# EAGLE design BIM Backplane (EAGLE 5.12)
FUNCTION: BIM 3; PARTNO: 67996-114HLF
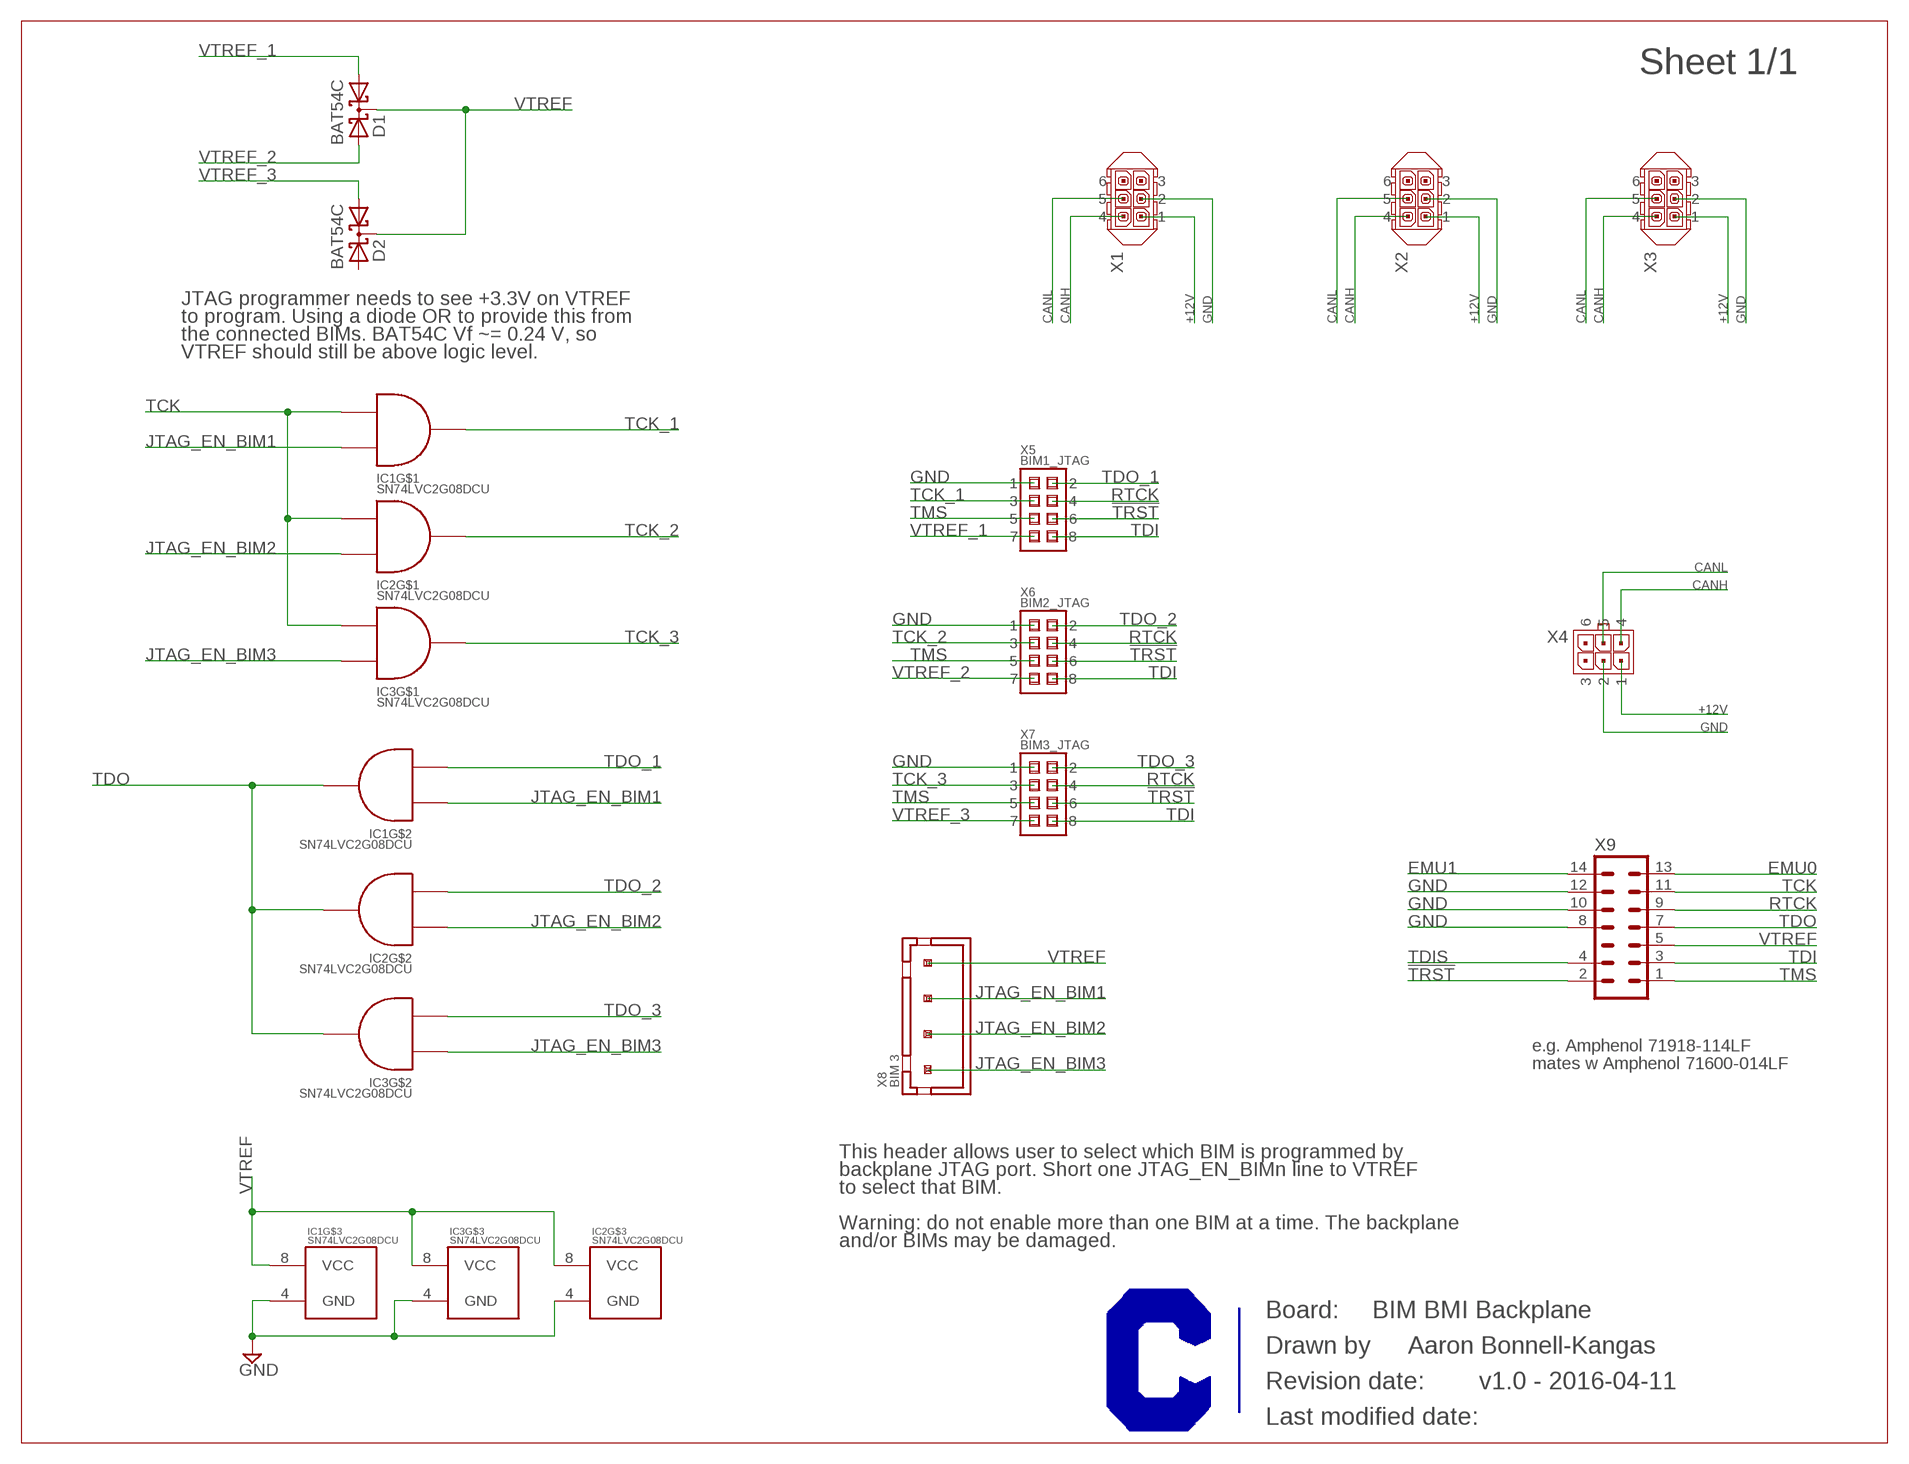
[diagram p0: schematic, sheet 1]

## Parts
D1  BAT54C  [SOT23]
D2  BAT54C  [SOT23]
IC1  SN74LVC2G08DCU  [DCU_(R-PDSO-G8)]
IC2  SN74LVC2G08DCU  [DCU_(R-PDSO-G8)]
IC3  SN74LVC2G08DCU  [DCU_(R-PDSO-G8)]
X1  MICROFIT-6-HDR-VERT  [MICROFIT-6-BMI-THROUGH_HOLE-VERT-PEG_RETENTION]
X2  MICROFIT-6-HDR-VERT  [MICROFIT-6-BMI-THROUGH_HOLE-VERT-PEG_RETENTION]
X3  MICROFIT-6-HDR-VERT  [MICROFIT-6-BMI-THROUGH_HOLE-VERT-PEG_RETENTION]
X4  MICROFIT-06-DUAL-GOLD-THRU-POLARIZING_PEG-VERT  [MICROFIT-6-VERT-THRU-POLARIZING_PEG]
X5  BIM1_JTAG  AMPMODU_SHROUDED_FEMALE_HEADER_0.1_8POS  [5-534206-4_8POS_PIN_HEADER]
X6  BIM2_JTAG  AMPMODU_SHROUDED_FEMALE_HEADER_0.1_8POS  [5-534206-4_8POS_PIN_HEADER]
X7  BIM3_JTAG  AMPMODU_SHROUDED_FEMALE_HEADER_0.1_8POS  [5-534206-4_8POS_PIN_HEADER]
X8  XH-4CKT-VERT-THRU  [B4B-XH-A]
X9  JTAG_HEADER  [TI_JTAG_HEADER]

## Nets
!TRST: X5.6 X6.6 X7.6 X9.2(!TRST)
+12V: X1.1 X2.1 X3.1 X4.1
CANH: X1.4 X2.4 X3.4 X4.4
CANL: X1.5 X2.5 X3.5 X4.5
EMU0: X9.13(EMU0)
EMU1: X9.14(EMU1)
GND: IC1.4(GND) IC2.4(GND) IC3.4(GND) X1.2 X2.2 X3.2 X4.2 X5.1 X6.1 X7.1 X9.8(GND) X9.10(GND) X9.12(GND)
JTAG_EN_BIM1: IC1.2(B) IC1.6(B) X8.3
JTAG_EN_BIM2: IC2.2(B) IC2.6(B) X8.2
JTAG_EN_BIM3: IC3.2(B) IC3.6(B) X8.1
RTCK: X5.4 X6.4 X7.4 X9.9(TCK)
TCK: IC1.1(A) IC2.1(A) IC3.1(A) X9.11
TCK_1: IC1.7(Y) X5.3
TCK_2: IC2.7(Y) X6.3
TCK_3: IC3.7(Y) X7.3
TDI: X5.8 X6.8 X7.8 X9.3(TDI)
TDIS: X9.4(GND)
TDO: IC1.3(Y) IC2.3(Y) IC3.3(Y) X9.7(TDO)
TDO_1: IC1.5(A) X5.2
TDO_2: IC2.5(A) X6.2
TDO_3: IC3.5(A) X7.2
TMS: X5.5 X6.5 X7.5 X9.1(TMS)
VTREF: D1.3(CC) D2.3(CC) IC1.8(VCC) IC2.8(VCC) IC3.8(VCC) X8.4 X9.5(VTREF)
VTREF_1: D1.1(A1) X5.7
VTREF_2: D1.2(A2) X6.7
VTREF_3: D2.1(A1) X7.7
Unconnected: D2.2(A2) X1.3 X1.6 X2.3 X2.6 X3.3 X3.6 X4.3 X4.6

## Notes on the sheet
- JTAG programmer needs to see +3.3V on VTREF
- to program. Using a diode OR to provide this from
- the connected BIMs. BAT54C Vf ~= 0.24 V, so
- VTREF should still be above logic level.
- e.g. Amphenol 71918-114LF
- mates w Amphenol 71600-014LF
- This header allows user to select which BIM is programmed by
- backplane JTAG port. Short one JTAG_EN_BIMn line to VTREF
- to select that BIM.
- Warning: do not enable more than one BIM at a time. The backplane
- and/or BIMs may be damaged.
- BIM BMI Backplane
- Aaron Bonnell-Kangas
- v1.0 - 2016-04-11

## Library data of the parts
D1 D2 = diode:BAT54C: Schottky Diodes Source: Fairchild .. BAT54.pdf
IC1-IC3 = TI:SN74LVC2G08: SN74LVC2G08 - Dual 2-Input Positive-AND Gate Datasheet: http://www.ti.com/lit/ds/symlink/sn74lvc2g08.pdf; PARTNO: SN74LVC2G08DCU
X1-X3 = Molex:MICROFIT-6-HDR: Molex Micro-Fit BMI (blind-mate interface) header, 6 circuits, vertical, through-hole Datasheet: http://www.molex.com/pdm_docs/sd/447690401_sd.pdf; PARTNO: 44769-0602
X4 = Molex:MICROFIT-06-DUAL: Molex MicroFit 3.00mm Pitch Header, Surface Mount, Dual Row, 6 Circuits Note, November 2014: These come in three styles: Through-hole, with metal clip retention to PCB (not currently represented) (cheapest) SMD, with solder tab retention (-SMD) (more expensive, commonly stocked) SMD, with metal clip retention (-SMD-CLIP_RETENTION) (most expensive, not often stocked) Please use them in that order! Drawing: http://www.molex.com/pdm_docs/sd/430450609_sd.pdf (right-angle) Information: http://www.molex.com/molex/products/datasheet.jsp?part=active/0430450618_PCB_HEADERS.xml; PARTNO: 43045-0613
X5-X7 = TE:AMPMODU_SHROUDED_FEMALE_HEADER_0.1_8POS: AMPMODU Mod II Receptacle Assembly, Dual-Row, 0.1"x0.1" Centerline, Female, 8 Positions Datasheet: http://datasheet.octopart.com/5-534206-4-Tyco-Electronics-datasheet-11077762.pdf; PARTNO: 5-534206-4
X8 = JST:XH-4CKT: XH connector, 4 circuits Datasheet: http://www.jst-mfg.com/product/pdf/eng/eXH.pdf; PARTNO: B4B-XH-A
X9 = TI:JTAG_HEADER: TI 14-pin JTAG header Reference: http://processors.wiki.ti.com/index.php/JTAG_Connectors

## Board
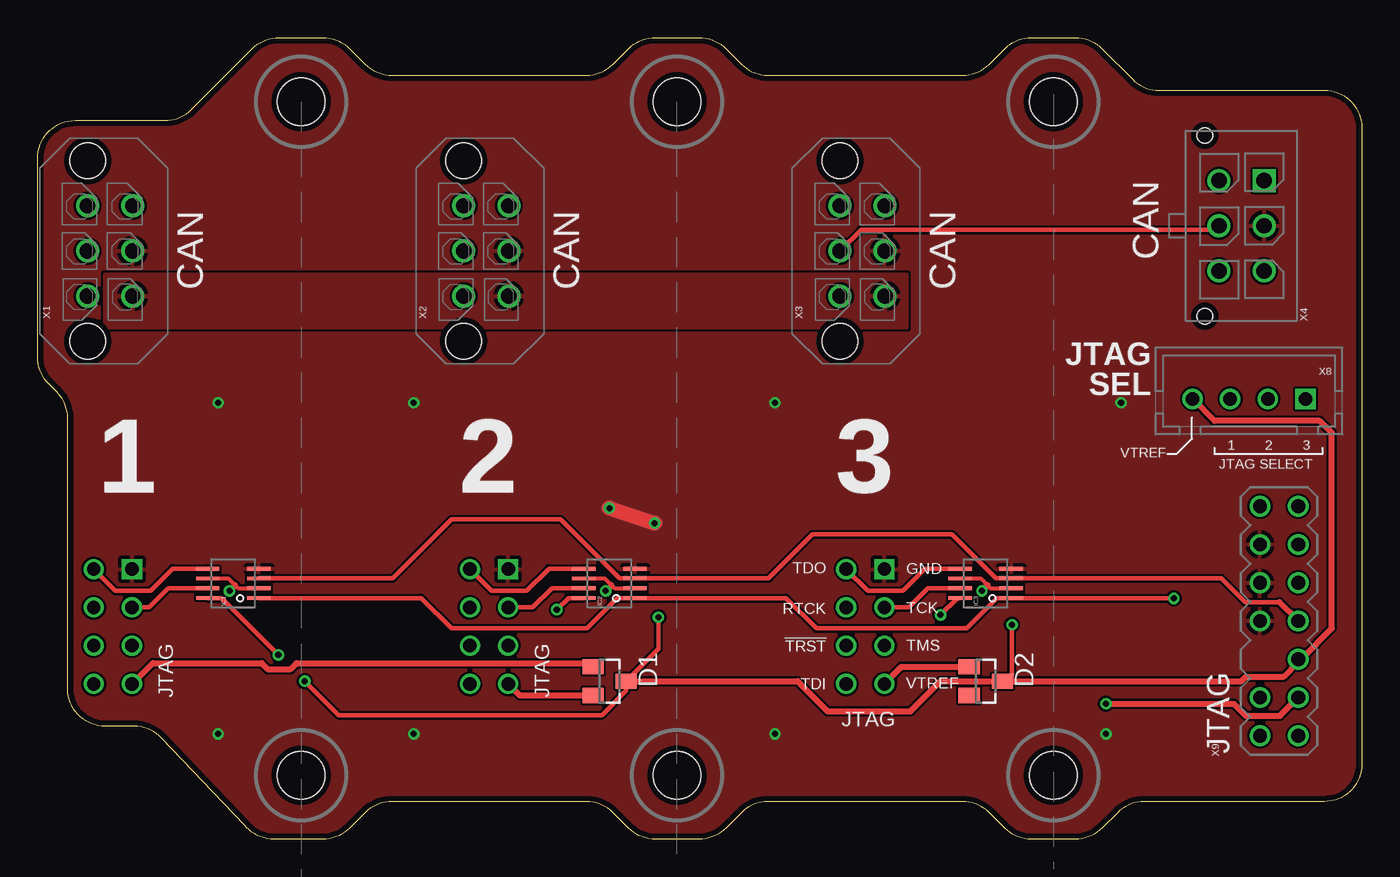
[diagram p1: board, top side]
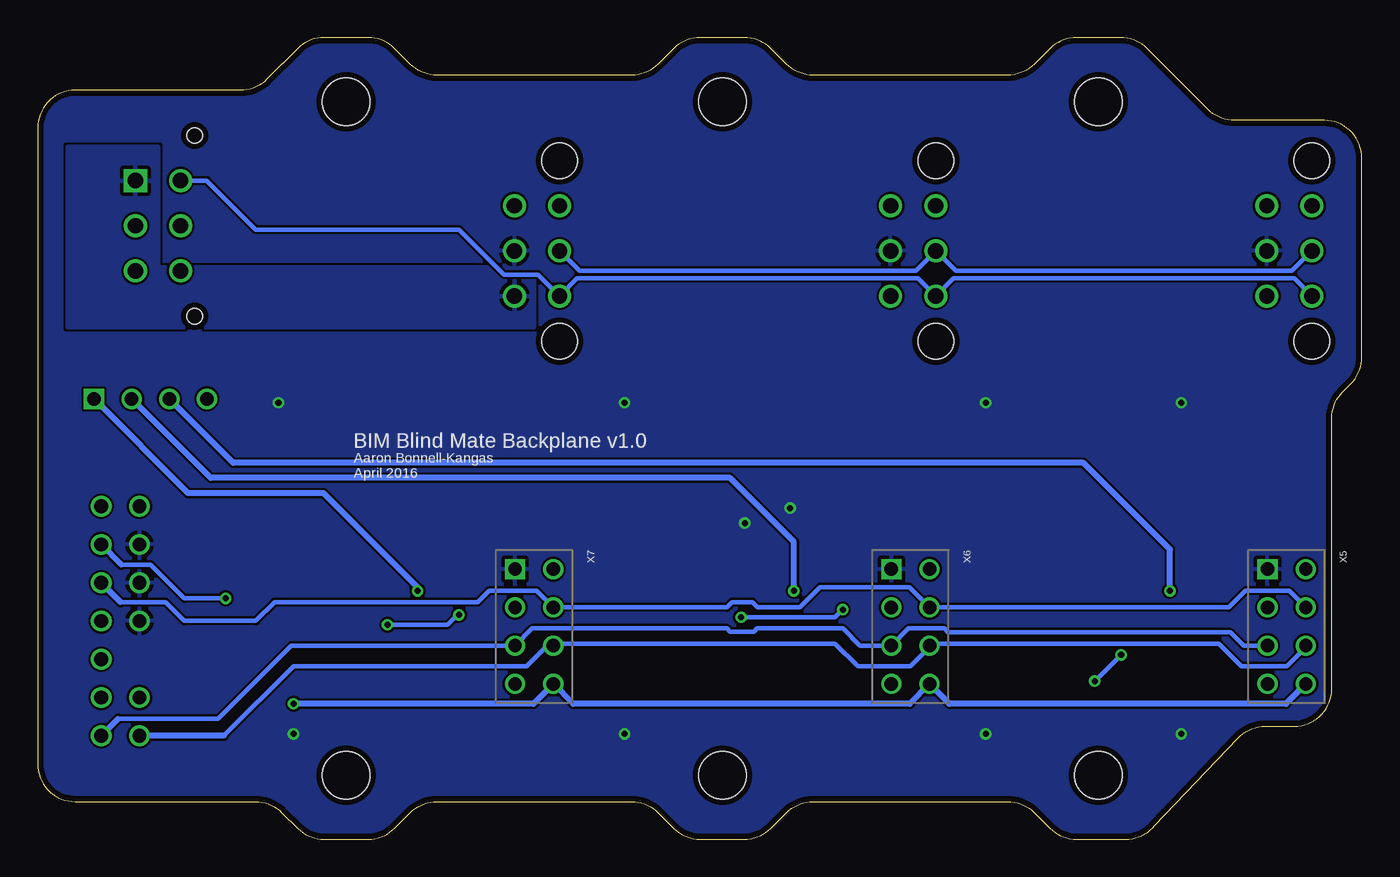
[diagram p2: board, bottom side, seen from below]

Size 88 x 53.25 mm. Coordinates in mm from the lower left corner, seen from the top.
Outline: 8.46,47.75 arc45 10.23,48.48 14.27,52.52 arc-45 16.04,53.25 18.96,53.25 arc-45 20.73,52.52 21.77,51.48 arc45 23.54,50.75 36.47,50.75 arc45 38.23,51.48 39.27,52.52 arc-45 41.03,53.25 43.97,53.25 arc-45 45.73,52.52 46.77,51.48 arc45 48.53,50.75 61.47,50.75 arc45 63.23,51.48 64.27,52.52 arc-45 66.03,53.25 68.97,53.25 arc-45 70.73,52.52 72.77,50.48 arc45 74.53,49.75 85.5,49.75 arc-90 88,47.25 88,5 arc-90 85.5,2.5 73.53,2.5 arc45 71.77,1.77 70.73,0.73 arc-45 68.97,0 66.03,0 arc-45 64.27,0.73 63.23,1.77 arc45 61.47,2.5 48.53,2.5 arc45 46.77,1.77 45.73,0.73 arc-45 43.97,0 41.03,0 arc-45 39.27,0.73 38.23,1.77 arc45 36.47,2.5 23.54,2.5 arc45 21.77,1.77 20.73,0.73 arc-45 18.96,0 15.7,0 arc-51 13.75,0.94 8.24,6.72 arc46 6.43,7.5 4.5,7.5 arc-90 2,10 2,27.96 arc45 1.27,29.73 0.73,30.27 arc-45 0,32.03 0,45.25 arc-90 2.5,47.75 8.46,47.75
Copper layers (1*16): Top 0.0356mm / dielectric 1.5011mm / Bottom 0.0356mm
Design rules "OSH Park 2-layer": minimum track width 6mil, minimum drill 13mil, track to track 6mil, track to pad 6mil, pad to pad 6mil, via to via 6mil, smd to smd 6mil, copper to edge 15mil, drill to drill 6mil, minimum pad ring 7mil, minimum via ring 7mil, stop-mask expansion 4mil, vias tented up to drill 25mil, thermal gap 10mil
Holes 3.15 mm at 17.5,4.25 42.5,4.25 67.5,4.25 17.5,49 42.5,49 67.5,49

### Footprints (pad centres in the part's own frame; a part is rotated, then mirrored left to right if it is on the bottom)
SOT23 = smd 1 x 1.4: 1 -0.95,-1.1; 2 0.95,-1.1; 3 0,1.1
DCU_(R-PDSO-G8) = smd 0.25 x 1.55: 1 -0.975,-1.7; 2 -0.325,-1.7; 3 0.325,-1.7; 4 0.975,-1.7; 5 0.975,1.7; 6 0.325,1.7; 7 -0.325,1.7; 8 -0.975,1.7
MICROFIT-6-BMI-THROUGH_HOLE-VERT-PEG_RETENTION = drill 1.02 round: 1 -3,-1.5; 2 0,-1.5; 3 3,-1.5; 4 -3,1.5; 5 0,1.5; 6 3,1.5 | hole 2.36: 6,1.5; -6,1.5
MICROFIT-6-VERT-THRU-POLARIZING_PEG = drill 1.02 square: 1 3,-1.5 | drill 1.02 round: 2 0,-1.5; 3 -3,-1.5; 4 3,1.5; 5 0,1.5; 6 -3,1.5 | hole 1.02: 6,2.44; -6,2.44
5-534206-4_8POS_PIN_HEADER = drill 0.889 square: 1 -3.81,-1.27 | drill 0.889 round: 2 -3.81,1.27; 3 -1.27,-1.27; 4 -1.27,1.27; 5 1.27,-1.27; 6 1.27,1.27; 7 3.81,-1.27; 8 3.81,1.27
B4B-XH-A = drill 0.9 square: 1 -3.75,0 | drill 0.9 round: 2 -1.25,0; 3 1.25,0; 4 3.75,0
TI_JTAG_HEADER = drill 0.914 round: 1 -7.62,-1.27; 2 -7.62,1.27; 3 -5.08,-1.27; 4 -5.08,1.27; 5 -2.54,-1.27; 7 0,-1.27; 8 0,1.27; 9 2.54,-1.27; 10 2.54,1.27; 11 5.08,-1.27; 12 5.08,1.27; 13 7.62,-1.27; 14 7.62,1.27

### Placement (x,y rotation side)
D1  38,10.5 270 top
D2  63,10.5 270 top
IC1  13,17 90 top
IC2  38,17 90 top
IC3  63,17 90 top
X1  4.82,39.08 90 top
X2  29.82,39.08 90 top
X3  54.82,39.08 90 top
X4  80,40.75 90 top
X5  5,14.13 270 bottom
X6  30,14.13 270 bottom
X7  55,14.13 270 bottom
X8  80.5,29.25 180 top
X9  82.5,14.5 90 top

### Tracks (layer width: path | path; a pad name or v marks a point on that pad's centre or on a via)
!TRST
  Bottom 0.3: 75.62,6.88 71,11.5 55.5,11.5 54.14,12.86 X7.6 53.59,13 35,13 33.5,11.5 30,11.5 28.73,12.77 X6.6 28.59,13 9.5,13 8,11.5 5,11.5 3.73,12.77 X5.6
  Bottom 0.4: 75.62,6.88 X9.2
+12V
  pour Top: 57.75,37.5 4.5,37.5 4.5,34 57.75,34
  pour Bottom: 55,38 55,34 86,34 86,46 80,46 80,38
CANH
  Bottom 0.3: X1.4 4.49,37.25 27.15,37.25 X2.4 29.49,37.25 52.15,37.25 X3.4 54.75,37.5 57,37.5 60,40.5 73.5,40.5 76.75,43.75 X4.4
CANL
  Top 0.3: X3.5 54.74,40.5 78.25,40.5 X4.5
  Bottom 0.3: X1.5 4.65,37.75 26.99,37.75 X2.5 29.65,37.75 51.99,37.75 X3.5
GND  (via drill 0.4)
  Top 1: v38,22 v41,21
  other vias: 71,7 49,7 25,7 12,7 12,29 25,29 49,29 72,29
  pour Top (rank 2): -5,54 95,54 95,-1 -5,-1
  pour Bottom (rank 2): -5,54 -5,-1 95,-1 95,54
JTAG_EN_BIM1  (via drill 0.4)
  Top 0.25: IC1.6 12.68,17.32 13.12,16.88 13.32,16.68 IC1.2
  Top 0.4: 13.12,16.88 v12.75,16.5
  Bottom 0.4: X8.3 75,25 18.5,25 12.75,19.25 v12.75,16.5
JTAG_EN_BIM2  (via drill 0.4)
  Top 0.25: IC2.6 37.67,17.32 38.12,16.88 38.33,16.68 IC2.2
  Top 0.4: 38.12,16.88 v37.75,16.5
  Bottom 0.4: X8.2 76.5,24 42,24 37.75,19.75 v37.75,16.5
JTAG_EN_BIM3  (via drill 0.4)
  Top 0.25: IC3.6 62.67,17.32 63.12,16.88 63.33,16.68 IC3.2
  Top 0.4: 63.12,16.88 v62.75,16.5
  Bottom 0.4: X8.1 78,23 69,23 62.75,16.75 v62.75,16.5
RTCK
  Bottom 0.3: 82.48,15.75 79.5,15.75 78.25,14.5 73.5,14.5 72.25,15.75 58.75,15.75 58,16.5 54.83,16.5 X7.4 42.2,15.4 41.85,15.75 40.5,15.75 40.15,15.4 37.35,15.4 36,16.75 30.08,16.75 X6.4 8.85,15.4 7.75,16.5 4.83,16.5 X5.4
  Bottom 0.4: 82.48,15.75 X9.9
TCK  (via drill 0.4)
  Top 0.3: IC1.1 25.48,16.02 27.5,14 36.5,14 38.5,16 39.67,16 IC2.1 49.73,16.02 51.75,14 61.75,14 63.75,16 64.67,16 IC3.1 75.47,16.02 v75.5,16
  Bottom 0.3: v75.5,16 78.25,16 80.5,18.25 82.44,18.25
  Bottom 0.4: 82.44,18.25 X9.11
TCK_1
  Top 0.3: IC1.7 8.68,16.68 7.4,15.4 X5.3
TCK_2
  Top 0.3: IC2.7 34.17,16.68 32.9,15.4 X6.3
TCK_3
  Top 0.3: IC3.7 59.17,16.68 57.9,15.4 X7.3
TDI  (via drill 0.4)
  Top 0.4: 82.55,8.2 X9.3
  Top 0.406: v71,9 79.5,9 80.3,8.2 82.55,8.2
  Bottom 0.4: X5.8 5.05,9 27.41,9 X6.8 30.05,9 52.41,9 X7.8 55.05,9 v71,9
TDO
  Top 0.3: 82.52,15.75 80.25,15.75 78.67,17.32 IC3.3 63.67,17.32 60.75,20.25 51.5,20.25 48.58,17.32 IC2.3 38.67,17.32 34.75,21.25 27.5,21.25 23.57,17.32 IC1.3
  Top 0.4: 82.52,15.75 X9.7
TDO_1
  Top 0.3: IC1.5 8.97,17.98 7.5,16.5 5.17,16.5 X5.2
TDO_2
  Top 0.3: IC2.5 33.98,17.98 32.5,16.5 30.17,16.5 X6.2
TDO_3
  Top 0.3: IC3.5 58.98,17.98 57.5,16.5 55.17,16.5 X7.2
TMS
  Bottom 0.3: 82.65,8 76,8 71.14,12.86 X7.5 55.13,14 42.2,14 42,13.8 40.4,13.8 40.2,14 34.5,14 33.36,12.86 X6.5 30.13,14 27.75,14 27.5,13.75 8.75,13.75 7.86,12.86 X5.5
  Bottom 0.4: 82.65,8 X9.1
VTREF  (via drill 0.4)
  Top 0.3: IC2.8 35.27,16.02 v34.5,15.25 | v41.25,14.75 41.25,12.65 D1.3 39.1,9.85 37.5,8.25 20,8.25 v17.75,10.5 | IC3.8 61.12,16.02 v60,14.9 | v64.75,14.25 64.75,10.75 64.5,10.5 | IC1.8 12.23,16.02 v16,12.25
  Top 0.4: D1.3 50.5,10.5 52.5,8.5 58,8.5 60,10.5 D2.3 64.5,10.5 80,10.5 80.3,10.8 82.8,10.8 83.75,11.75 84,12 | X8.4 78.2,27.8 85.2,27.8 86,27 86,14 84,12 | 84,12 83.81,12 X9.5
  Bottom 0.3: v34.5,15.25 35,14.75 v41.25,14.75 | v60,14.9 60.1,14.9 60.75,14.25 v64.75,14.25 | v16,12.25 v17.75,10.5
VTREF_1
  Top 0.4: X5.7 7.65,11.7 14.9,11.7 15.3,11.3 16.8,11.3 17.2,11.7 36.5,11.7 36.75,11.45 D1.1
VTREF_2
  Top 0.4: X6.7 32.04,9.55 D1.2
VTREF_3
  Top 0.4: X7.7 57.4,11.45 D2.1

### Text on the board
tPlace: CAN | CAN | CAN | CAN | JTAG | SEL | VTREF | 1 | 2 | 3 | JTAG SELECT | 1 | 2 | 3 | TDO | GND | RTCK | TCK | JTAG | JTAG | !TRST | TMS | TDI | VTREF | JTAG | JTAG
bPlace: BIM Blind Mate Backplane v1.0 | Aaron Bonnell-Kangas | April 2016